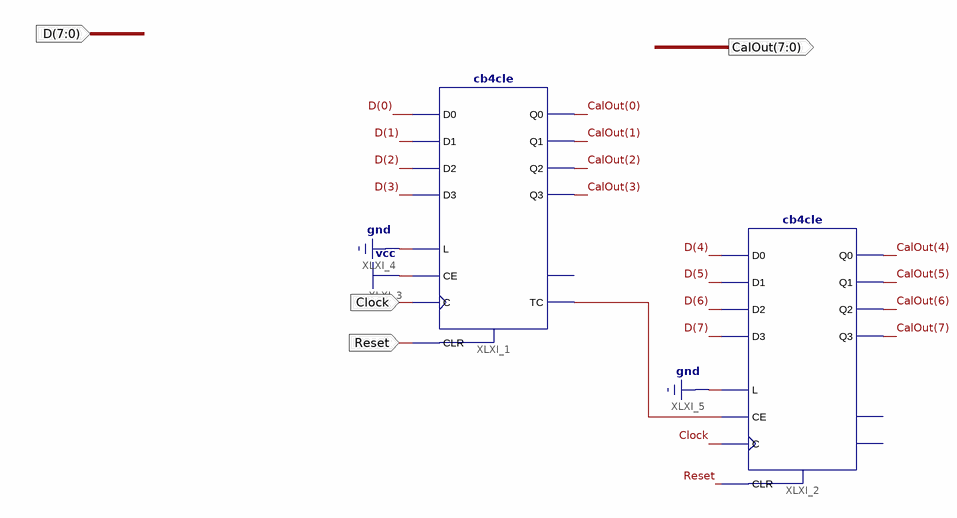
[diagram p0: schematic sheet 1]
// Xilinx ISE schematic dwe2.sch (spartan3) as structural Verilog: 2 symbols, 4 ports
module dwe2 (
  input  [7:0] D,
  input  Clock,
  input  Reset,
  output [7:0] CalOut
);

  wire XLXN_7;

  cb4cle XLXI_1 (
    .C(Clock), .CE(1'b1), .CLR(Reset), .D0(D[0]), .D1(D[1]), .D2(D[2]), .D3(D[3]), .L(1'b0), .Q0(CalOut[0]),
    .Q1(CalOut[1]), .Q2(CalOut[2]), .Q3(CalOut[3]), .TC(XLXN_7));  // open: CEO
  cb4cle XLXI_2 (
    .C(Clock), .CE(XLXN_7), .CLR(Reset), .D0(D[4]), .D1(D[5]), .D2(D[6]), .D3(D[7]), .L(1'b0),
    .Q0(CalOut[4]), .Q1(CalOut[5]), .Q2(CalOut[6]), .Q3(CalOut[7]));  // open: CEO, TC
endmodule
